# EasyEDA Pro project ProProject_基于CW32单片机的伺服电机控制器_2024-03-17.epro

# Schematic Schematic1

## Sheets
1 P1: Create Date: 2024-02-22; Page Name: P1; Project Name: 基于CW32单片机的伺服电机控制器; Schematic Name: Schematic1; Update Date: 2024-03-03; Company: 嘉立创EDA; Page Size: A4; Version: V1.0
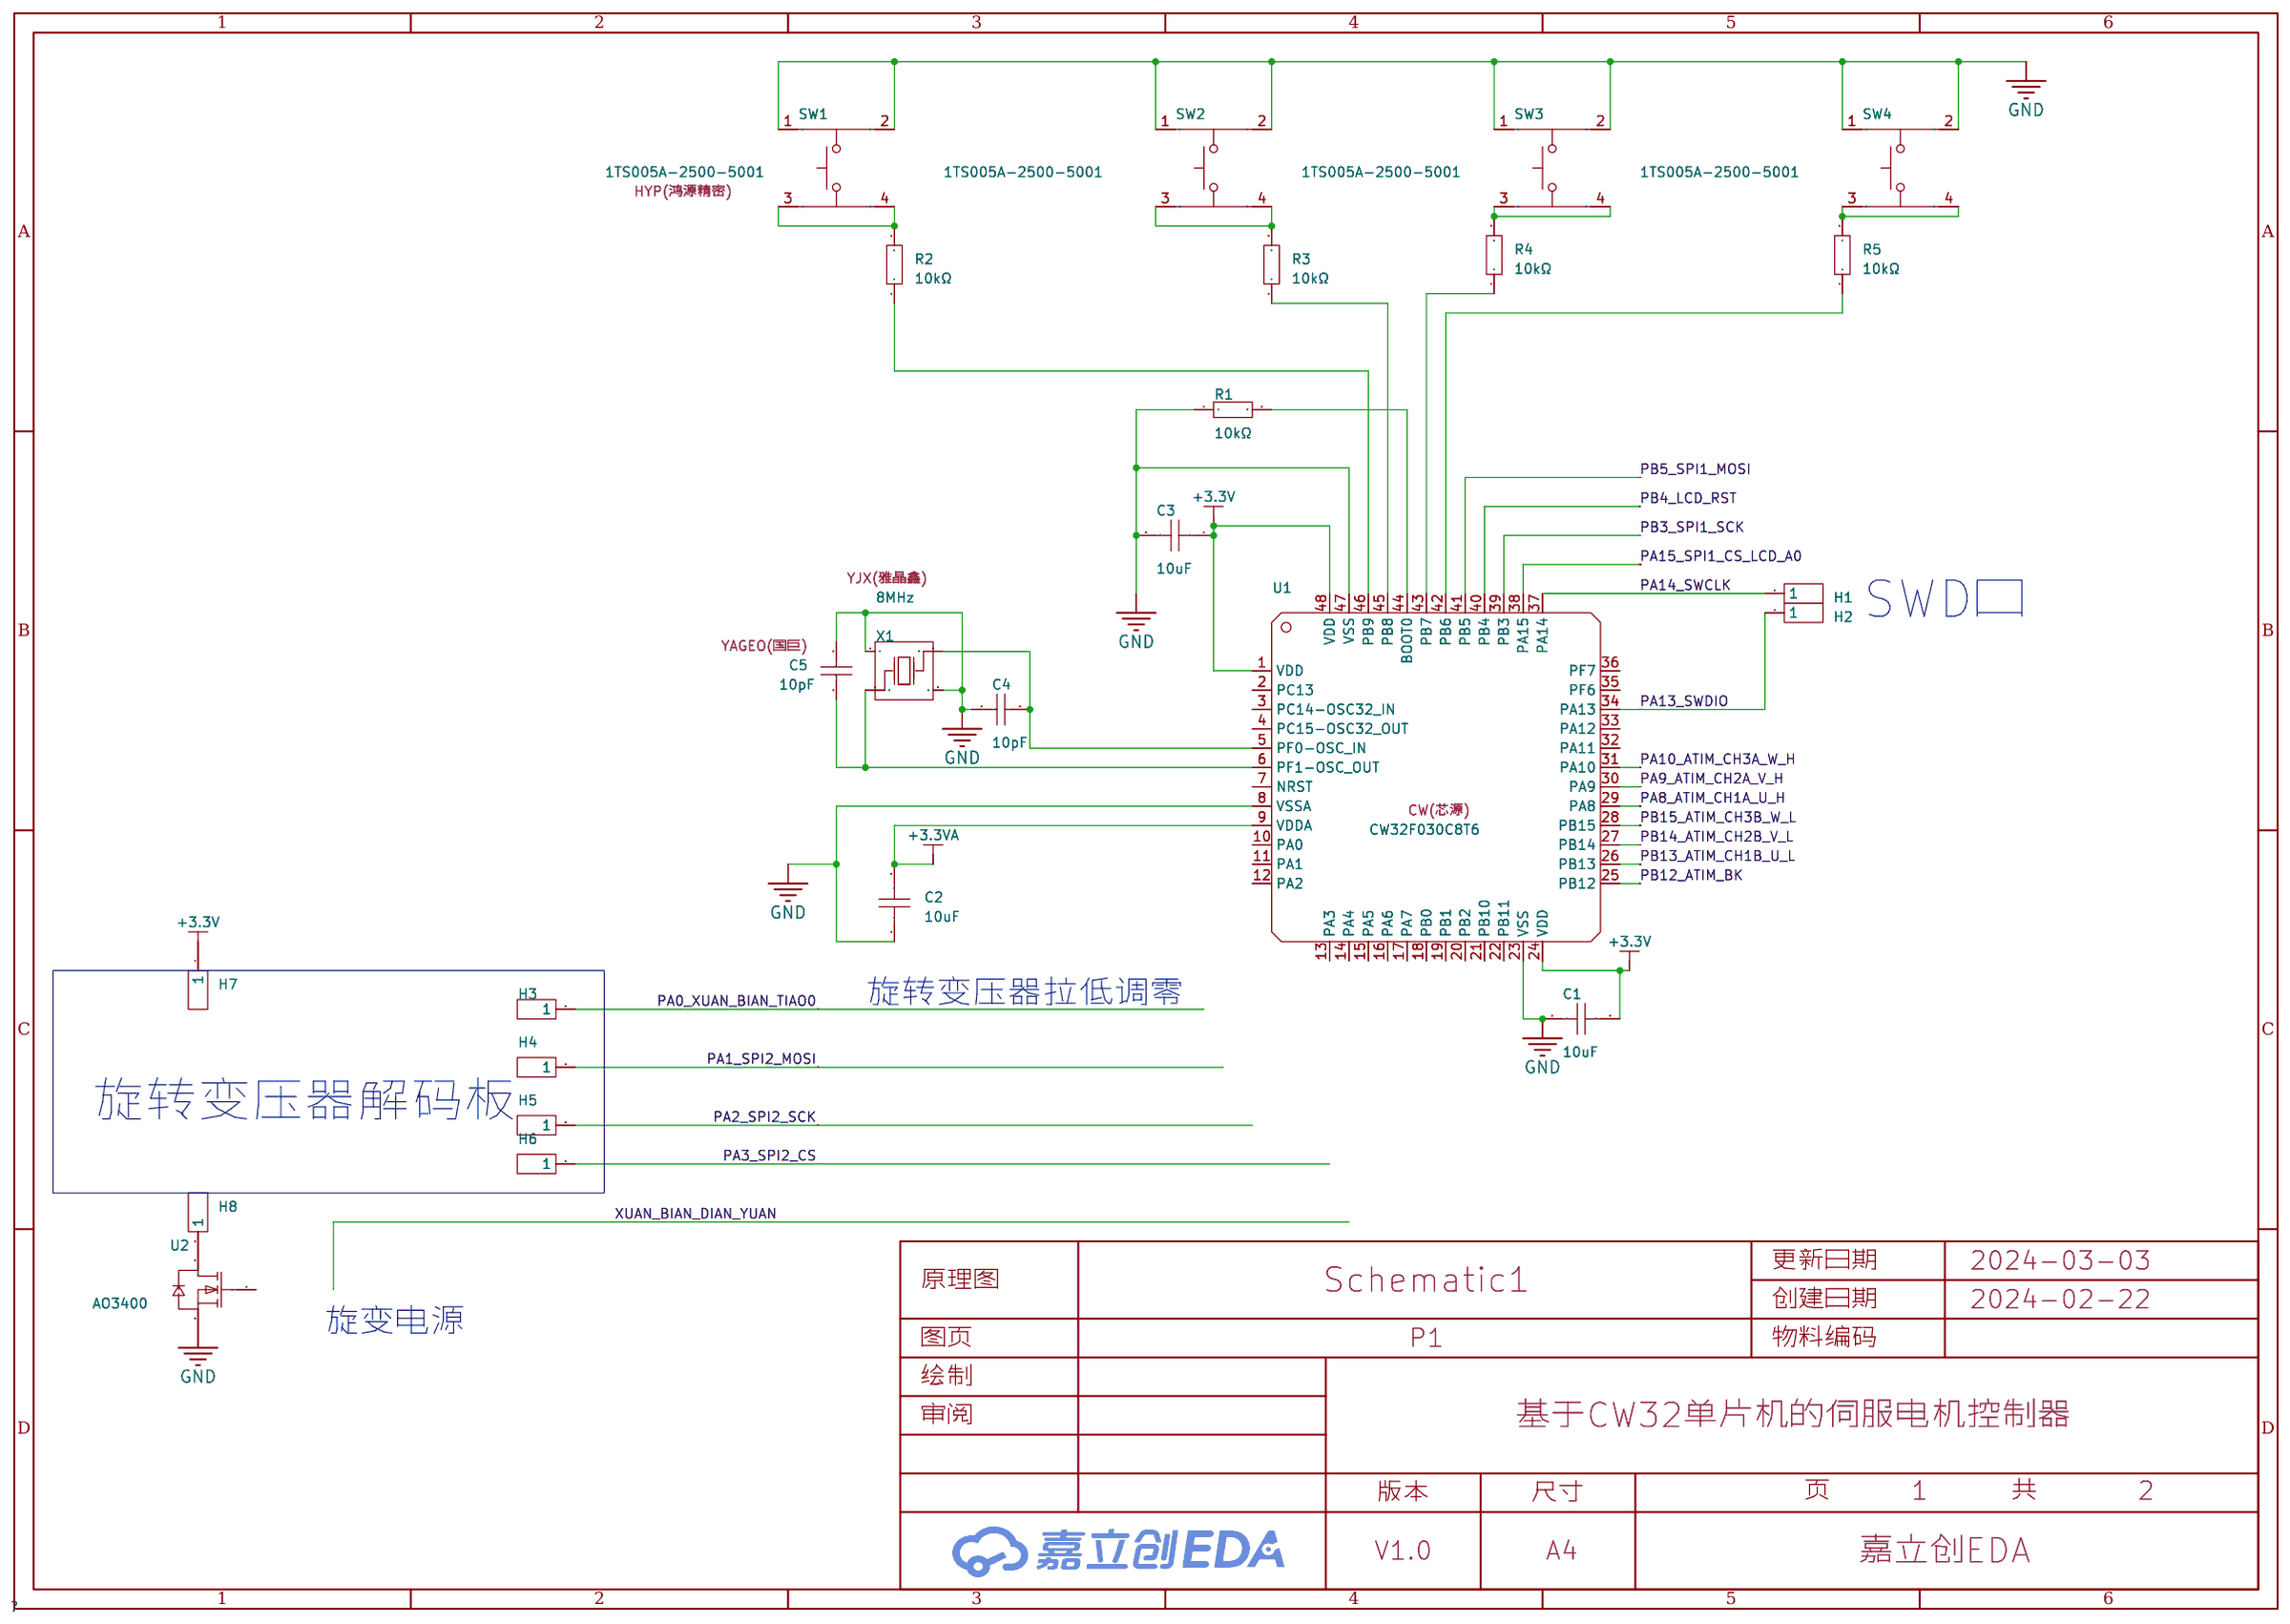
[diagram p0: P1]
2 P2: Create Date: 2024-03-02; Page Name: P2
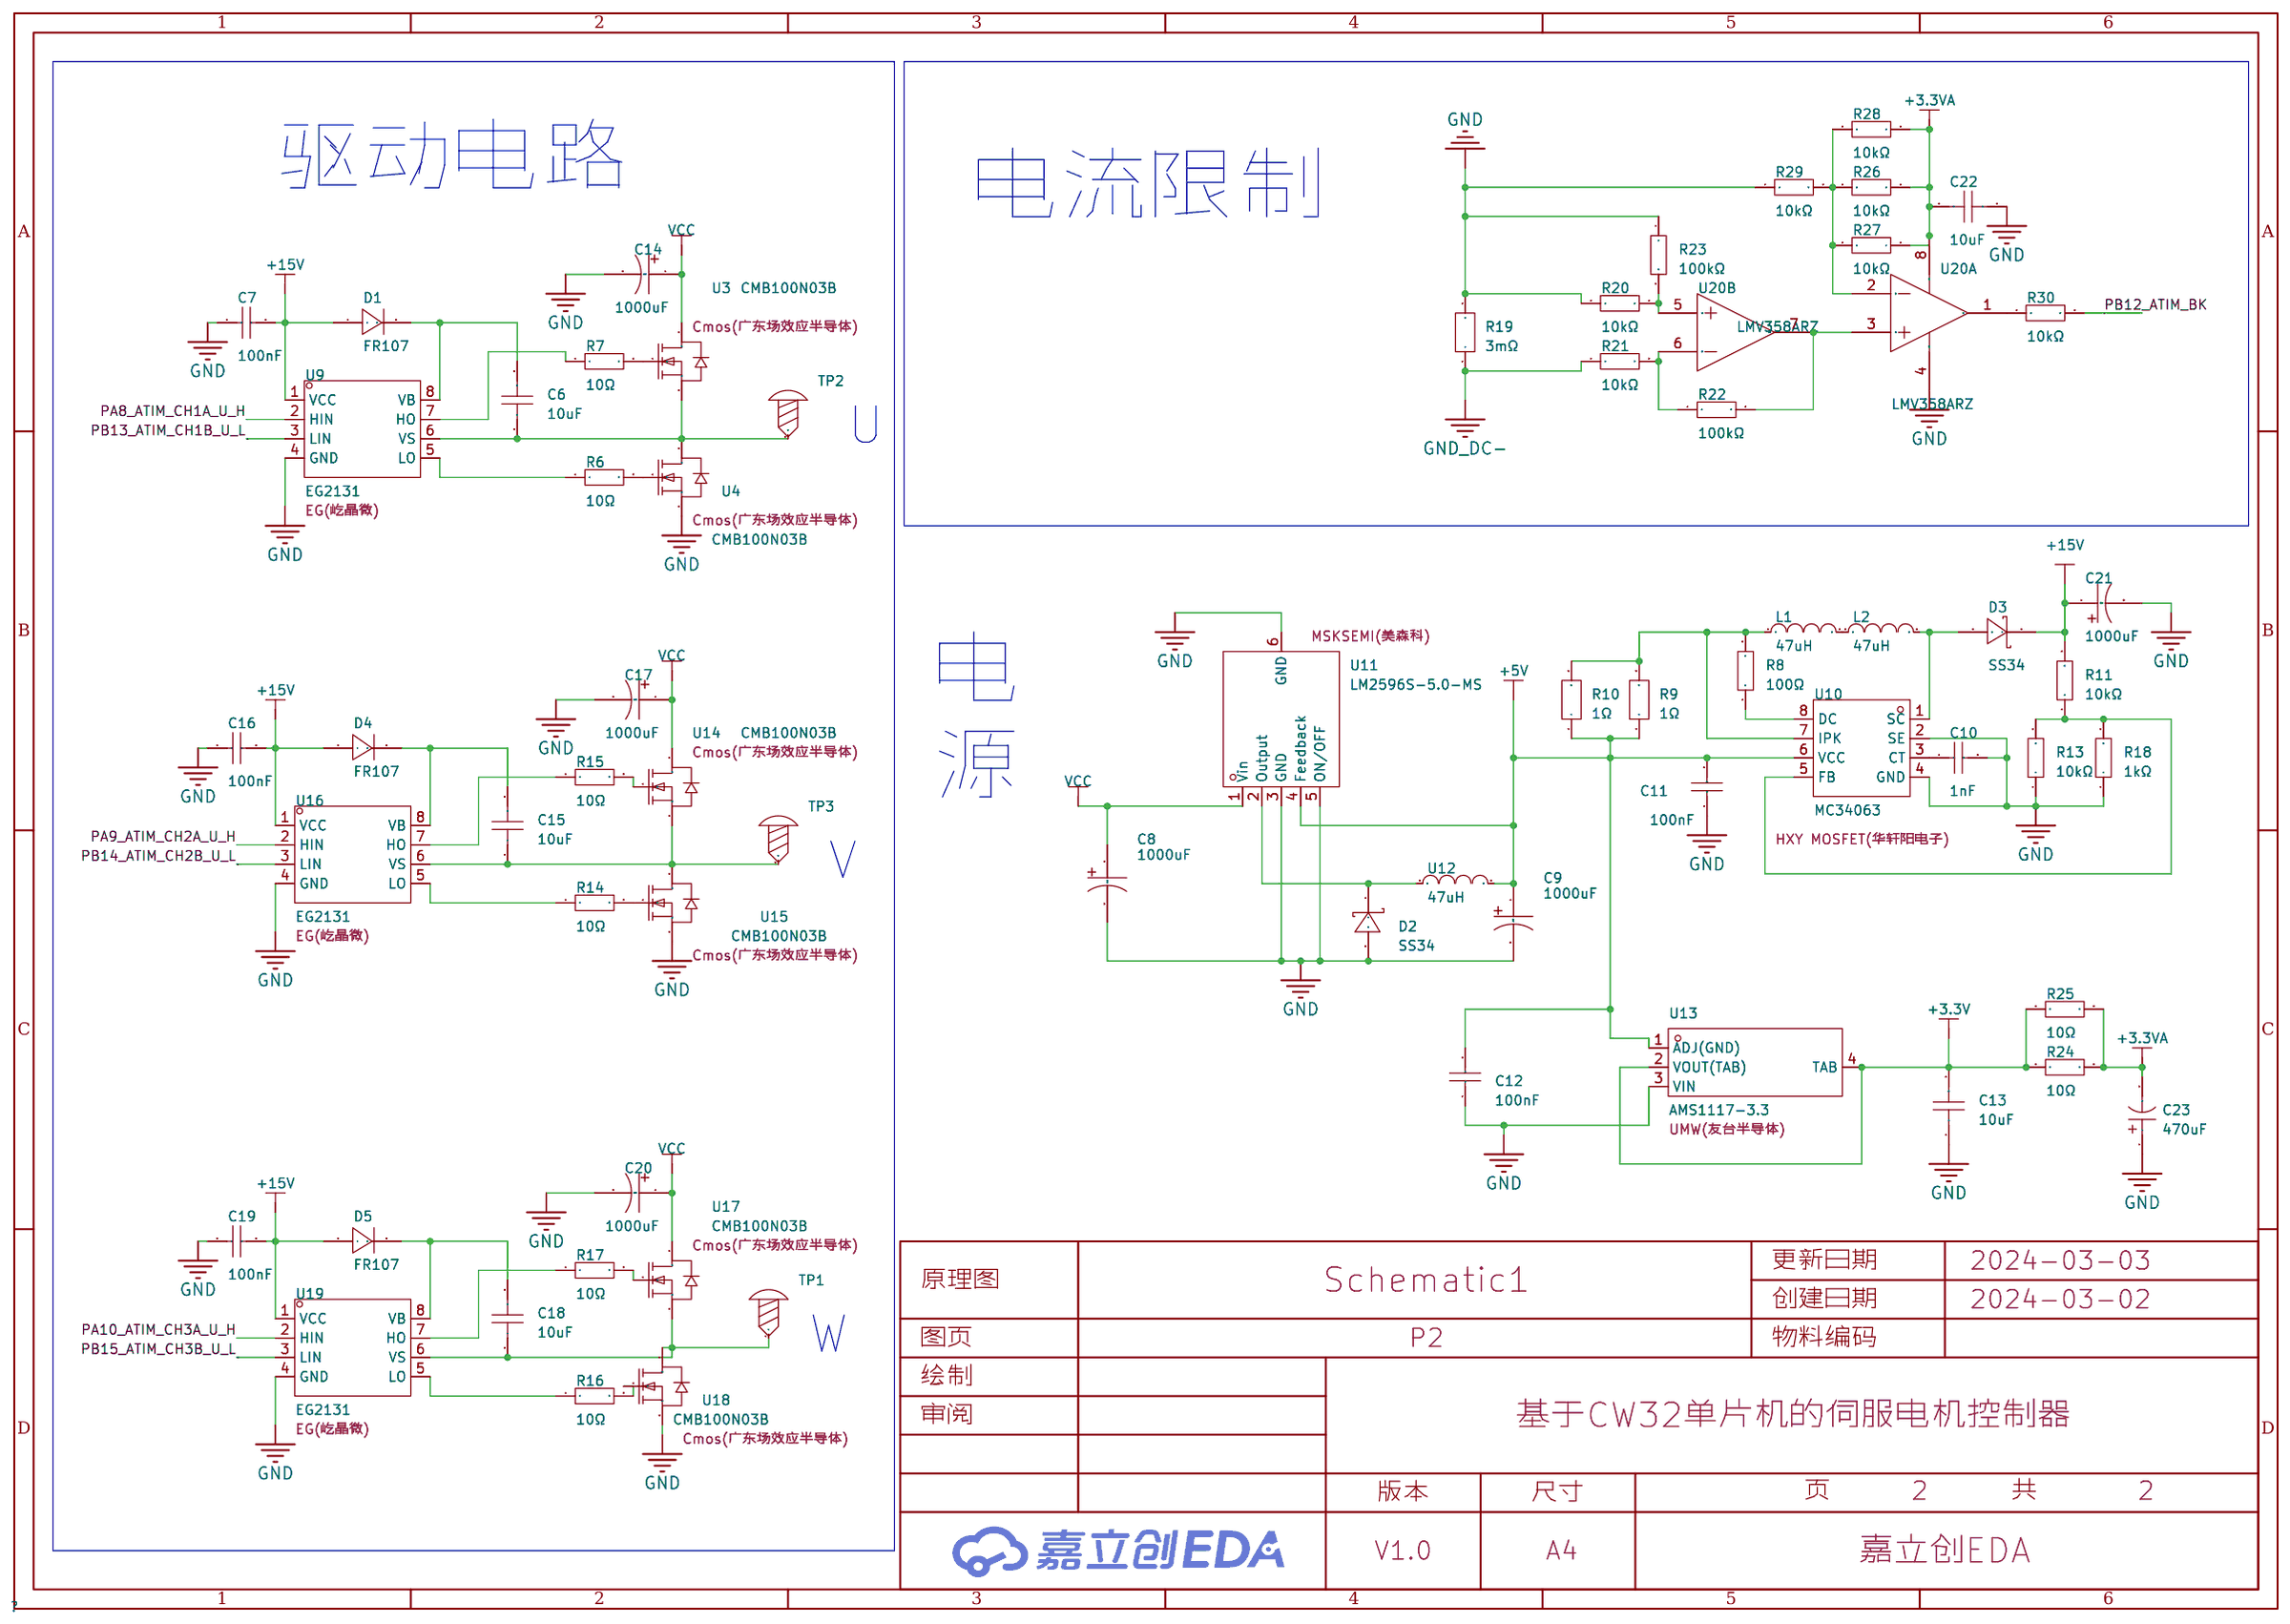
[diagram p1: P2]

## Parts
sheet P1
C1  10uF  [C0603]
C2  10uF  [C0603]
C3  10uF  [C0603]
C4  10pF  [C0603]
C5  10pF  [C0603]
H1  -  [HDR-TH_1P-V-M_XKB_X4611WV-01I-C28D40]
H2  -  [HDR-TH_1P-V-M_XKB_X4611WV-01I-C28D40]
H3  -  [HDR-TH_1P-V-M_XKB_X4611WV-01I-C28D40]
H4  -  [HDR-TH_1P-V-M_XKB_X4611WV-01I-C28D40]
H5  -  [HDR-TH_1P-V-M_XKB_X4611WV-01I-C28D40]
H6  -  [HDR-TH_1P-V-M_XKB_X4611WV-01I-C28D40]
H7  -  [HDR-TH_1P-V-M_XKB_X4611WV-01I-C28D40]
H8  -  [HDR-TH_1P-V-M_XKB_X4611WV-01I-C28D40]
R1  10kΩ  [R0603]
R2  10kΩ  [R0603]
R3  10kΩ  [R0603]
R4  10kΩ  [R0603]
R5  10kΩ  [R0603]
SW1  1TS005A-2500-5001  [SW-TH_4P-L6.0-W6.0-P3.90-LS6.5]
SW2  1TS005A-2500-5001  [SW-TH_4P-L6.0-W6.0-P3.90-LS6.5]
SW3  1TS005A-2500-5001  [SW-TH_4P-L6.0-W6.0-P3.90-LS6.5]
SW4  1TS005A-2500-5001  [SW-TH_4P-L6.0-W6.0-P3.90-LS6.5]
U1  CW32F030C8T6  [LQFP-48_L7.0-W7.0-P0.50-LS9.0-TL]
U2  AO3400  [SOT-23-3_L2.9-W1.3-P0.95-LS2.4-BR]
X1  8MHz  [OSC-SMD_4P-L3.2-W2.5-BL]
sheet P2
C6  10uF  [C0805]
C7  100nF  [C0603]
C8  1000uF  [CAP-TH_BD10.0-P5.00-D1.0-FD]
C9  1000uF  [CAP-TH_BD10.0-P5.00-D1.0-FD]
C10  1nF  [C0603]
C11  100nF  [C0603]
C12  100nF  [C0603]
C13  10uF  [C0603]
C14  1000uF  [CAP-TH_BD10.0-P5.00-D1.0-FD]
C15  10uF  [C0805]
C16  100nF  [C0603]
C17  1000uF  [CAP-TH_BD10.0-P5.00-D1.0-FD]
C18  10uF  [C0805]
C19  100nF  [C0603]
C20  1000uF  [CAP-TH_BD10.0-P5.00-D1.0-FD]
C21  1000uF  [CAP-TH_BD10.0-P5.00-D1.0-FD]
C22  10uF  [C0603]
C23  470uF  [CAP-TH_BD10.0-P5.00-D0.6-FD]
D1  FR107  [DO-41_BD2.4-L4.7-P8.70-D0.9-FD]
D2  SS34  [SMA_L4.3-W2.6-LS5.2-RD]
D3  SS34  [SMA_L4.3-W2.6-LS5.2-RD]
D4  FR107  [DO-41_BD2.4-L4.7-P8.70-D0.9-FD]
D5  FR107  [DO-41_BD2.4-L4.7-P8.70-D0.9-FD]
L1  47uH  [IND-SMD_L4.5-W4.0_SLF0403]
L2  47uH  [IND-SMD_L4.5-W4.0_SLF0403]
R6  10Ω  [R0603]
R7  10Ω  [R0603]
R8  100Ω  [R0603]
R9  1Ω  [R0603]
R10  1Ω  [R0603]
R11  10kΩ  [R0603]
R13  10kΩ  [R0603]
R14  10Ω  [R0603]
R15  10Ω  [R0603]
R16  10Ω  [R0603]
R17  10Ω  [R0603]
R18  1kΩ  [R0603]
R19  3mΩ  [R5930]
R20  10kΩ  [R0603]
R21  10kΩ  [R0603]
R22  100kΩ  [R0603]
R23  100kΩ  [R0603]
R24  10Ω  [R0603]
R25  10Ω  [R0603]
R26  10kΩ  [R0603]
R27  10kΩ  [R0603]
R28  10kΩ  [R0603]
R29  10kΩ  [R0603]
R30  10kΩ  [R0603]
TP1  -  [M4螺丝]
TP2  -  [M4螺丝]
TP3  -  [M4螺丝]
U3  CMB100N03B  [TO-263-2_L10.1-W9.1-P5.08-LS15.2-BR]
U4  CMB100N03B  [TO-263-2_L10.1-W9.1-P5.08-LS15.2-BR]
U9  EG2131  [SOIC-8_L5.0-W4.0-P1.27-LS6.0-BL]
U10  MC34063  [SOIC-8_L5.0-W4.0-P1.27-LS6.0-BL]
U11  LM2596S-5.0-MS  [TO-263-5_L10.0-W8.4-P1.70-LS15.3-BR]
U12  47uH  [IND-SMD_L7.1-W6.6]
U13  AMS1117-3.3  [SOT-223-4_L6.5-W3.5-P2.30-LS7.0-BR]
U14  CMB100N03B  [TO-263-2_L10.1-W9.1-P5.08-LS15.2-BR]
U15  CMB100N03B  [TO-263-2_L10.1-W9.1-P5.08-LS15.2-BR]
U16  EG2131  [SOIC-8_L5.0-W4.0-P1.27-LS6.0-BL]
U17  CMB100N03B  [TO-263-2_L10.1-W9.1-P5.08-LS15.2-BR]
U18  CMB100N03B  [TO-263-2_L10.1-W9.1-P5.08-LS15.2-BR]
U19  EG2131  [SOIC-8_L5.0-W4.0-P1.27-LS6.0-BL]
U20  LMV358ARZ  [SOP-8_L4.9-W3.9-P1.27-LS6.0-BL]  (sections 1,2)

## Library data of the parts
C1-C3 C13 C22 = CL10A106KP8NNNC: 容值:10uF;精度:±10%;额定电压:10V;材质(温度系数):X5R;; LCSC Part Name: 10uF ±10% 10V; Supplier Part: C19702; Manufacturer: SAMSUNG(三星); Supplier Footprint: 0603; JLCPCB Part Class: 基础库; Datasheet: https://atta.szlcsc.com/upload/public/pdf/source/20160218/1457707763339.pdf; Supplier: LCSC; Tolerance: ±10%; Voltage Rated: 10V; Temperature Coefficient: X5R
C4 C5 = CC0603JRNPO9BN100: 容值:10pF;精度:±5%;额定电压:50V;材质(温度系数):NP0;; LCSC Part Name: 10pF ±5% 50V; Supplier Part: C106245; Manufacturer: YAGEO(国巨); Supplier Footprint: 0603; JLCPCB Part Class: 扩展库; Datasheet: https://atta.szlcsc.com/upload/public/pdf/source/20170505/1493957838062.pdf; Supplier: LCSC; Tolerance: ±5%; Voltage Rated: 50V; Temperature Coefficient: NP0
H1-H8 = HDR-M_2.54_1x1P: Supplier Part: C81276; Supplier Footprint: 插件; JLCPCB Part Class: Extended Part
R1-R5 R11 R13 R20 R21 R26-R30 = RC0603FR-0710KL: 电阻类型:厚膜电阻;阻值:10kΩ;精度:±1%;功率:100mW;最大工作电压:75V;温度系数:±100ppm/℃;; LCSC Part Name: 厚膜电阻 10kΩ ±1% 100mW; Supplier Part: C98220; Manufacturer: YAGEO(国巨); Supplier Footprint: 0603; JLCPCB Part Class: 扩展库; Datasheet: https://atta.szlcsc.com/upload/public/pdf/source/20180927/C295883_E8D83085EA81BD7DE0B2B681138C15EE.pdf; Supplier: LCSC; Type: 厚膜电阻; Tolerance: ±1%; Power(Watts): 100mW; Overload Voltage (Max): 75V; Temperature Coefficient: ±100ppm/℃; Operating Temperature Range: -55℃~+155℃
SW1-SW4 = 1TS005A-2500-5001: 电路结构:单刀单掷;按钮形状:圆形按钮;作用力:250gf;安装方式:直插;开关长度:6mm;开关宽度:6mm;开关高度:5mm;带支架:不带;触点电流:50mA;额定电压(DC):12V;额定功率:0.6W;绝缘电阻:100MΩ;带灯:无;机械寿命:7万次;; LCSC Part Name: 6*6*5mm 直插 轻触开关; Supplier Part: C255811; Manufacturer: HYP(鸿源精密); Supplier Footprint: 插件,6x6mm; JLCPCB Part Class: 扩展库; Datasheet: https://atta.szlcsc.com/upload/public/pdf/source/20180720/C255811_DA12C4E3C20854D48E888AEA64926F5F.pdf; Supplier: LCSC; Circuit: 单刀单掷; Actuator Style: 圆形按钮; Operating Force: 250gf; Mounting Style: 直插; Switch Length: 6mm; Switch Width: 6mm; Switch Height: 5mm; Strike Gundam: 不带; Contact Current: 50mA; Voltage Rating (DC): 12V; Power Rating: 0.6W; Insulation Resistance: 100MΩ; Actuator/Cap Color: 黑色; With Lamp: 无; Pin Style: PC引脚; Mechanical Life: 7万次; Operating Temperature: -40℃~+90℃
U1 = CW32F030C8T6_C3019113: CPU内核:ARM-M系列;RAM总容量:8KB;GPIO端口数量:39;工作电压范围:1.65V~5.5V;CPU最大主频:64MHz;程序存储器类型:-;; Supplier Part: C3019113; Manufacturer: CW(芯源); Supplier Footprint: LQFP-48(7x7); JLCPCB Part Class: 扩展库; Datasheet: https://atta.szlcsc.com/upload/public/pdf/source/20220516/D60F5E1023A73FFF550D4A77416DDFBC.pdf; Supplier: LCSC; CPU Core: ARM-M系列; RAM Size: 8KB; GPIO Ports Number: 39; Operating Voltage Range: 1.65V~5.5V; CPU Maximum Speed: 64MHz; Operating Temperature Range: -40℃~+105℃; ADC (Bit): 12bit; 16Bit Timer: 8; UART/USART: 3; I2C: 2; SPI: 2; Internal Comparator: 有; Peripheral/Function: 片载温度传感器；DMA；看门狗；低电压检测；CRC校验; Watchdog: 有; Low-Voltage Detect: 有; Direct Memory Access: 有
U2 = AO3400_C5224189: 类型:N沟道;漏源电压(Vdss):30V;连续漏极电流(Id):6A;功率(Pd):1.4W;导通电阻(RDS(on)@Vgs,Id):19mΩ@10V,6.0A;阈值电压(Vgs(th)@Id):1V@250uA;; LCSC Part Name: N沟道 耐压:30V 电流:6A; Supplier Part: C5224189; Manufacturer: ElecSuper(静芯微); Supplier Footprint: SOT-23; JLCPCB Part Class: 扩展库; Datasheet: https://atta.szlcsc.com/upload/public/pdf/source/20221027/ABD635DBC9233A91F749288ED25D371B.pdf; Supplier: LCSC; Type: N沟道; Drain Source Voltage (Vdss): 30V; Continuous Drain Current (Id): 6A; Power Dissipation (Pd): 1.4W; Drain Source On Resistance (RDS(on)@Vgs,Id): 19mΩ@10V,6.0A; Gate Threshold Voltage (Vgs(th)@Id): 1V@250uA
X1 = TAXM8M4RDBCCT2T: 晶振类型:贴片晶振;频率:8MHz;常温频差:±10ppm;外接负载电容:10pF;频率稳定度(全温):±15ppm;; LCSC Part Name: 8MHz ±10ppm 10pF; Supplier Part: C400090; Manufacturer: YJX(雅晶鑫); Supplier Footprint: SMD3225-4P; JLCPCB Part Class: 扩展库; Datasheet: https://atta.szlcsc.com/upload/public/pdf/source/20190626/C400090_CF95B89E745AFE4EF2E392EF8AC009D6.pdf; Supplier: LCSC; Crystal Type: 贴片晶振; Normal temperature Frequency Tolerance: ±10ppm; External load capacitor: 10pF; Frequency Stability(Full temperature range): ±15ppm; Equivalent Series Resistance (ESR): 250Ω; Operating Temperature: -40℃~+85℃
C6 C15 C18 = CL21A106KAYNNNE_C15850: 容值:10uF;精度:±10%;额定电压:25V;材质(温度系数):X5R;; LCSC Part Name: 10uF ±10% 25V; Supplier Part: C15850; Manufacturer: SAMSUNG(三星); Manufacturer Part: CL21A106KAYNNNE; Supplier Footprint: 0805; JLCPCB Part Class: 基础库; Datasheet: https://atta.szlcsc.com/upload/public/pdf/source/20160218/1457707763339.pdf; Supplier: LCSC; Tolerance: ±10%; Voltage Rated: 25V; Temperature Coefficient: X5R
C7 C11 C12 C16 C19 = 0603B104K500NT: 容值:100nF;精度:±10%;额定电压:50V;材质(温度系数):X7R;; LCSC Part Name: 100nF ±10% 50V; Supplier Part: C30926; Manufacturer: FH(风华); Supplier Footprint: 0603; JLCPCB Part Class: 扩展库; Datasheet: https://atta.szlcsc.com/upload/public/pdf/source/20200305/C486355_26A10D38EF8C2A5C37091D0039909270.pdf; Supplier: LCSC; Tolerance: ±10%; Voltage Rated: 50V; Temperature Coefficient: X7R
C8 C9 C14 C17 C20 C21 = ERR1VM102G20OT: 容值:1000uF;精度:±20%;额定电压:35V;; LCSC Part Name: 1000uF ±20% 35V; Supplier Part: C398835; Manufacturer: AISHI(艾华集团); Supplier Footprint: 插件,D10xL20mm; JLCPCB Part Class: 扩展库; Datasheet: https://atta.szlcsc.com/upload/public/pdf/source/20190702/C401591_1676EF45BC9A88BD1D6B22BBAE3913C7.pdf; Supplier: LCSC; Tolerance: ±20%; Rated Voltage: 35V; Lead Spacing: 5mm; φD: 10mm; L: 20mm; Lifetime @ Temp: 2000hrs@105℃
C10 = CC0603JRNPO9BN102: 容值:1nF;精度:±5%;额定电压:50V;材质(温度系数):NP0;; LCSC Part Name: 1nF ±5% 50V; Supplier Part: C106246; Manufacturer: YAGEO(国巨); Supplier Footprint: 0603; JLCPCB Part Class: 扩展库; Datasheet: https://atta.szlcsc.com/upload/public/pdf/source/20170505/1493957838062.pdf; Supplier: LCSC; Tolerance: ±5%; Voltage Rated: 50V; Temperature Coefficient: NP0
C23 = 35V470uF CD110: 容值:470uF;精度:±20%;额定电压:35V;; LCSC Part Name: 470uF ±20% 35V; Supplier Part: C2960394; Manufacturer: HRK(鸿瑞凯电子); Supplier Footprint: 插件,D10xL17mm; JLCPCB Part Class: 扩展库; Datasheet: https://atta.szlcsc.com/upload/public/pdf/source/20220224/D53946E56E2AF613ECCDBE172010D613.pdf; Supplier: LCSC; Tolerance: ±20%; Rated Voltage: 35V; Lead Spacing: 5mm; φD: 10mm; L: 17mm; Operating Temperature: -40℃~+105℃
D1 D4 D5 = FR107_C35253: 二极管配置:-;正向压降(Vf):1.3V@1A;直流反向耐压(Vr):1kV;平均整流电流(Io):1A;反向恢复时间(trr):500ns;; LCSC Part Name: 电压:1kV 电流:1A; Supplier Part: C35253; Manufacturer: MDD; Supplier Footprint: DO-41; JLCPCB Part Class: 扩展库; Datasheet: https://atta.szlcsc.com/upload/public/pdf/source/20230823/95EC475391AED3EACDBE81DA6E12F611.pdf; Supplier: LCSC; Forward Voltage (Vf@If): 1.3V@1A; Reverse Voltage (Vr): 1kV; Average Rectified Current (Io): 1A; Reverse Leakage Current: 5uA@1kV; Reverse Recovery Time (trr): 500ns; Operating Temperature: -65℃~+150℃@(Tj)
D2 D3 = SS34_C8678: 二极管配置:独立式;正向压降(Vf):550mV@3A;直流反向耐压(Vr):40V;平均整流电流(Io):3A;; LCSC Part Name: 电压:40V 电流:3A; Supplier Part: C8678; Manufacturer: MDD; Supplier Footprint: SMA(DO-214AC); JLCPCB Part Class: 基础库; Datasheet: https://atta.szlcsc.com/upload/public/pdf/source/20230314/A80AE34493C69B89E2F4B1712F433538.pdf; Supplier: LCSC; Diode Configuration: 独立式; Forward Voltage (Vf@If): 550mV@3A; Reverse Voltage (Vr): 40V; Average Rectified Current (Io): 3A; Reverse Leakage Current (Ir): 500uA@40V
L1 L2 = SLF0403-470KTT: 电感值:47uH;精度:±10%;额定电流:540mA;; LCSC Part Name: 47uH ±10%; Supplier Part: C182152; Manufacturer: Sunltech(韩国顺磁); Supplier Footprint: SMD; JLCPCB Part Class: 扩展库; Datasheet: https://atta.szlcsc.com/upload/public/pdf/source/20180622/C182201_C2E2778B6752CF513C201C52BBFBA88C.pdf; Supplier: LCSC; Tolerance: ±10%; Rated Current: 540mA; DC Resistance (DCR): 844mΩ
R6 R7 R14-R17 R24 R25 = 0603WAF100JT5E: 电阻类型:厚膜电阻;阻值:10Ω;精度:±1%;功率:100mW;最大工作电压:75V;温度系数:±400ppm/℃;; LCSC Part Name: 10Ω ±1% 100mW 厚膜电阻; Supplier Part: C22859; Manufacturer: UNI-ROYAL(厚声); Supplier Footprint: 0603; JLCPCB Part Class: 基础库; Datasheet: https://atta.szlcsc.com/upload/public/pdf/source/20200306/C422600_1E6D84923E4A46A82E41ADD87F860B5C.pdf; Supplier: LCSC; Type: 厚膜电阻; Tolerance: ±1%; Power(Watts): 100mW; Overload Voltage (Max): 75V; Temperature Coefficient: ±400ppm/℃; Operating Temperature Range: -55℃~+155℃
R8 = RC0603FR-07100RL: 电阻类型:厚膜电阻;阻值:100Ω;精度:±1%;功率:100mW;最大工作电压:75V;温度系数:±100ppm/℃;; LCSC Part Name: 厚膜电阻 100Ω ±1% 100mW; Supplier Part: C105588; Manufacturer: YAGEO(国巨); Supplier Footprint: 0603; JLCPCB Part Class: 扩展库; Datasheet: https://atta.szlcsc.com/upload/public/pdf/source/20180316/70C0E2BDAE7FCC62C531A5A58D202EE1.pdf; Supplier: LCSC; Type: 厚膜电阻; Tolerance: ±1%; Power(Watts): 100mW; Overload Voltage (Max): 75V; Temperature Coefficient: ±100ppm/℃; Operating Temperature Range: -55℃~+155℃
R9 R10 = SCR0603F1R: 电阻类型:厚膜电阻;阻值:1Ω;精度:±1%;功率:100mW;最大工作电压:75V;; LCSC Part Name: 1Ω ±1%; Supplier Part: C3016186; Manufacturer: VO(翔胜); Supplier Footprint: 0603; JLCPCB Part Class: 扩展库; Datasheet: https://atta.szlcsc.com/upload/public/pdf/source/20220513/247AF9639BA21CF93567DC289CCC6A22.pdf; Supplier: LCSC; Type: 厚膜电阻; Tolerance: ±1%; Power(Watts): 100mW; Overload Voltage (Max): 75V; Operating Temperature Range: -55℃~+155℃
R18 = RC0603FR-071KL: 电阻类型:厚膜电阻;阻值:1kΩ;精度:±1%;功率:100mW;最大工作电压:75V;温度系数:±100ppm/℃;; LCSC Part Name: 厚膜电阻 1kΩ ±1% 100mW; Supplier Part: C22548; Manufacturer: YAGEO(国巨); Supplier Footprint: 0603; JLCPCB Part Class: 扩展库; Datasheet: https://atta.szlcsc.com/upload/public/pdf/source/20180316/70C0E2BDAE7FCC62C531A5A58D202EE1.pdf; Supplier: LCSC; Type: 厚膜电阻; Tolerance: ±1%; Power(Watts): 100mW; Overload Voltage (Max): 75V; Temperature Coefficient: ±100ppm/℃; Operating Temperature Range: -55℃~+155℃
R19 = EBWS5930F3L00K9L: 电阻类型:采样电阻;阻值:3mΩ;精度:±1%;额定压降:-;功率:7W;温度系数:±100ppm/℃;安装方式:贴片;; LCSC Part Name: 3mΩ ±1% 7W; Supplier Part: C494596; Manufacturer: RESI(开步睿思）; Supplier Footprint: 5930; JLCPCB Part Class: 扩展库; Datasheet: https://atta.szlcsc.com/upload/public/pdf/source/20200428/C494572_1906A236A7F16EA247B6F3B5657545A5.pdf; Supplier: LCSC; Type: 采样电阻; Tolerance: ±1%; Power(Watts): 7W; Temperature Coefficient: ±100ppm/℃; Mounting Sytle: 贴片
R22 R23 = RC0603FR-07100KL: 电阻类型:厚膜电阻;阻值:100kΩ;精度:±1%;功率:100mW;最大工作电压:75V;温度系数:±100ppm/℃;; LCSC Part Name: 厚膜电阻 100kΩ ±1% 100mW; Supplier Part: C14675; Manufacturer: YAGEO(国巨); Supplier Footprint: 0603; JLCPCB Part Class: 扩展库; Datasheet: https://atta.szlcsc.com/upload/public/pdf/source/20140324/1457707028752.pdf; Supplier: LCSC; Type: 厚膜电阻; Tolerance: ±1%; Power(Watts): 100mW; Overload Voltage (Max): 75V; Temperature Coefficient: ±100ppm/℃; Operating Temperature Range: -55℃~+155℃
TP1-TP3 = M4螺丝: Supplier Footprint: 插件
U3 U4 U14 U15 U17 U18 = CMB100N03B: 类型:N沟道;漏源电压(Vdss):30V;连续漏极电流(Id):100A;功率(Pd):300W;导通电阻(RDS(on)@Vgs,Id):4.5mΩ;; LCSC Part Name: N沟道 耐压:30V 电流:100A; Supplier Part: C5371853; Manufacturer: Cmos(广东场效应半导体); Supplier Footprint: TO-263; Datasheet: https://atta.szlcsc.com/upload/public/pdf/source/20230320/165F92A3EFB77C9B94AB5AF0C8680DBE.pdf; Supplier: LCSC; Type: N沟道; Drain Source Voltage (Vdss): 30V; Continuous Drain Current (Id): 100A; Power Dissipation (Pd): 300W; Drain Source On Resistance (RDS(on)@Vgs,Id): 4.5mΩ
U9 U16 U19 = EG2131: Supplier Part: C193777; Manufacturer: EG(屹晶微); Supplier Footprint: SOIC-8; JLCPCB Part Class: 扩展库; Datasheet: https://atta.szlcsc.com/upload/public/pdf/source/20180528/C193777_0A452F93B99FD4EB2A9D54E9055DABCE.pdf; Supplier: LCSC
U10 = MC34063_C5349988: 功能类型:升降压型;输出类型:可调;输入电压:3V~40V;输出电压:1.25V~40V;输出电流(最大值):1.3A;; Supplier Part: C5349988; Manufacturer: HXY MOSFET(华轩阳电子); Supplier Footprint: SOP-8; JLCPCB Part Class: 扩展库; Datasheet: https://atta.szlcsc.com/upload/public/pdf/source/20231229/D1A87F39F2F1E3F68C55B6C50423EC0B.pdf; Supplier: LCSC; Function: 升降压型; Output Type: 可调; Input Voltage: 3V~40V; Output Voltage: 1.25V~40V; Output Current (Max): 1.3A; Switching Frequency: 100kHz; Operating Temperature: 0℃~+70℃; Number of Outputs: 1; Switch tube (built-in/external): 内置
U11 = LM2596S-5.0-MS: 功能类型:降压型;输出类型:-;输入电压:7V~40V;输出电压:5V;输出电流(最大值):3A;; LCSC Part Name: Vin=7V-40V Vout=5V 3A大电流; Supplier Part: C5174628; Manufacturer: MSKSEMI(美森科); Supplier Footprint: TO-263-5L; JLCPCB Part Class: 扩展库; Datasheet: https://atta.szlcsc.com/upload/public/pdf/source/20221027/4361E163E0CC4DA461A3D8885FDCEFBB.pdf; Supplier: LCSC; Function: 降压型; Input Voltage: 7V~40V; Output Voltage: 5V; Output Current (Max): 3A; Switching Frequency: 150kHz; Synchronous Rectification: 否; Number of Outputs: 1; Topology: 降压式; Switch tube (built-in/external): 内置
U12 = APH0630T470M: 电感值:47uH;精度:±20%;额定电流:1.25A;饱和电流(Isat):1.66A;类型:一体成型电感;; LCSC Part Name: 47uH ±20% 1.66A; Supplier Part: C5349685; Manufacturer: APV(爱普微); Supplier Footprint: SMD,7x6.6mm; JLCPCB Part Class: 扩展库; Datasheet: https://atta.szlcsc.com/upload/public/pdf/source/20230920/8DF4F91CA8787177DE496A10F73889DA.pdf; Supplier: LCSC; Tolerance: ±20%; Rated Current: 1.25A; Saturation Current (Isat): 1.66A; DC Resistance (DCR): 385mΩ; Type: 一体成型电感
U13 = AMS1117-3.3_C347222: 输出类型:固定;最大输入电压:12V;输出电压:3.3V;最大输出电流:1A;电源纹波抑制比(PSRR):60dB@(120Hz);输出极性:正极;; LCSC Part Name: 输出:3.3V 电流:1A 耐压:12V; Supplier Part: C347222; Manufacturer: UMW(友台半导体); Supplier Footprint: SOT-223; JLCPCB Part Class: 扩展库; Datasheet: https://atta.szlcsc.com/upload/public/pdf/source/20231109/155D79A26D9DB04352555A58D5969DC8.pdf; Supplier: LCSC; Output Type: 固定; Maximum Input Voltage: 12V; Output Voltage: 3.3V; MAX Output Current: 1A; Power Supply Rejection Ratio (PSRR): 60dB@(120Hz); Dropout Voltage: 1.3V@(1A); Output Polarity: 正极; Number of Outputs: 1
U20 = LMV358ARZ: 放大器数:双路;; Supplier Part: C2928823; Manufacturer: HTCSEMI(海天芯); Supplier Footprint: SOP-8; JLCPCB Part Class: 扩展库; Datasheet: https://atta.szlcsc.com/upload/public/pdf/source/20220114/2D4B849A76DE33264688A93B3A90A0F8.pdf; Supplier: LCSC; Number of Circuits: 双路

## Nets
+3.3V: C1.2 C3.1 C13.2 H7.1 R24.1 R25.1 U1.1(VDD) U1.24(VDD) U1.48(VDD) U13.2(VOUT(TAB)) U13.4(TAB)
+3.3VA: C2.2 C22.2 C23.2 R24.2 R25.2 R26.2 R27.2 R28.2 U1.9(VDDA) U20.8(VCC)
+5V: C9.1 C11.2 C12.2 R9.1 R10.1 U10.6(VCC) U11.4(Feedback) U12.2 U13.1(ADJ(GND))
+15V: C7.2 C16.2 C19.2 C21.1 D1.1(A) D3.1(K) D4.1(A) D5.1(A) R11.2 U9.1(VCC) U16.1(VCC) U19.1(VCC)
GND: C1.1 C2.1 C3.2 C4.1 C5.2 C7.1 C8.2 C9.2 C10.2 C11.1 C12.1 C13.1 C14.2 C16.1 C17.2 C19.1 C20.2 C21.2 C22.1 C23.1 D2.2(A) R1.1 R13.1 R18.1 R19.2 R20.1 R23.1 R29.1 SW1.1 SW1.2 SW2.1 SW2.2 SW3.1 SW3.2 SW4.1 SW4.2 U1.8(VSSA) U1.23(VSS) U1.47(VSS) U2.2(S) U4.3(S) U9.4(GND) U10.2(SE) U10.4(GND) U11.3(GND) U11.5(ON/OFF) U11.6(GND) U13.3(VIN) U15.3(S) U16.4(GND) U18.3(S) U19.4(GND) U20.4(GND) X1.2 X1.4
GND_DC-: R19.1 R21.1
VCC: C8.1 C14.1 C17.1 C20.1 U3.2(D) U11.1(Vin) U14.2(D) U17.2(D)
PA0_XUAN_BIAN_TIAO0: H3.1
PA1_SPI2_MOSI: H4.1
PA2_SPI2_SCK: H5.1
PA3_SPI2_CS: H6.1
PA8_ATIM_CH1A_U_H: U1.29(PA8) U9.2(HIN)
PA9_ATIM_CH2A_U_H: U16.2(HIN)
PA9_ATIM_CH2A_V_H: U1.30(PA9)
PA10_ATIM_CH3A_U_H: U19.2(HIN)
PA10_ATIM_CH3A_W_H: U1.31(PA10)
PA13_SWDIO: H2.1 U1.34(PA13)
PA14_SWCLK: H1.1 U1.37(PA14)
PA15_SPI1_CS_LCD_A0: U1.38(PA15)
PB3_SPI1_SCK: U1.39(PB3)
PB4_LCD_RST: U1.40(PB4)
PB5_SPI1_MOSI: U1.41(PB5)
PB12_ATIM_BK: R30.2 U1.25(PB12)
PB13_ATIM_CH1B_U_L: U1.26(PB13) U9.3(LIN)
PB14_ATIM_CH2B_U_L: U16.3(LIN)
PB14_ATIM_CH2B_V_L: U1.27(PB14)
PB15_ATIM_CH3B_U_L: U19.3(LIN)
PB15_ATIM_CH3B_W_L: U1.28(PB15)
Net-(C4-2): C4.2 U1.5(PF0-OSC_IN) X1.3
Net-(C5-1): C5.1 U1.6(PF1-OSC_OUT) X1.1
Net-(C6-1): C6.1 TP2.1 U3.3(S) U4.2(D) U9.6(VS)
Net-(C6-2): C6.2 D1.2(K) U9.8(VB)
Net-(C10-1): C10.1 U10.3(CT)
Net-(C15-1): C15.1 TP3.1 U14.3(S) U15.2(D) U16.6(VS)
Net-(C15-2): C15.2 D4.2(K) U16.8(VB)
Net-(C18-1): C18.1 TP1.1 U17.3(S) U18.2(D) U19.6(VS)
Net-(C18-2): C18.2 D5.2(K) U19.8(VB)
Net-(D2-1): D2.1(K) U11.2(Output) U12.1
Net-(D3-2): D3.2(A) L2.2 U10.1(SC)
Net-(H8-1): H8.1 U2.3(D)
Net-(L1-1): L1.1 R8.2 R9.2 R10.2 U10.7(IPK)
Net-(L1-2): L1.2 L2.1
Net-(R1-2): R1.2 U1.44(BOOT0)
Net-(R2-1): R2.1 U1.46(PB9)
Net-(R2-2): R2.2 SW1.3 SW1.4
Net-(R3-1): R3.1 U1.45(PB8)
Net-(R3-2): R3.2 SW2.3 SW2.4
Net-(R4-1): R4.1 U1.43(PB7)
Net-(R4-2): R4.2 SW3.3 SW3.4
Net-(R5-1): R5.1 U1.42(PB6)
Net-(R5-2): R5.2 SW4.3 SW4.4
Net-(R6-1): R6.1 U9.5(LO)
Net-(R6-2): R6.2 U4.1(G)
Net-(R7-1): R7.1 U9.7(HO)
Net-(R7-2): R7.2 U3.1(G)
Net-(R8-1): R8.1 U10.8(DC)
Net-(R11-1): R11.1 R13.2 R18.2 U10.5(FB)
Net-(R14-1): R14.1 U16.5(LO)
Net-(R14-2): R14.2 U15.1(G)
Net-(R15-1): R15.1 U16.7(HO)
Net-(R15-2): R15.2 U14.1(G)
Net-(R16-1): R16.1 U19.5(LO)
Net-(R16-2): R16.2 U18.1(G)
Net-(R17-1): R17.1 U19.7(HO)
Net-(R17-2): R17.2 U17.1(G)
Net-(R20-2): R20.2 R23.2 U20.5(IN2+)
Net-(R21-2): R21.2 R22.1 U20.6(IN2-)
Net-(R22-2): R22.2 U20.3(IN1+) U20.7(OUT2)
Net-(R26-1): R26.1 R27.1 R28.1 R29.2 U20.2(IN1-)
Net-(R30-1): R30.1 U20.1(OUT)

Not connected (* = marked no-connect by the designer): U1 2(PC13) 3(PC14-OSC32_IN) 4(PC15-OSC32_OUT) 7(NRST) 10(PA0) 11(PA1) 12(PA2) 13(PA3) 14(PA4) 15(PA5) 16(PA6) 17(PA7) 18(PB0) 19(PB1) 20(PB2) 21(PB10) 22(PB11) 32(PA11) 33(PA12) 35(PF6) 36(PF7); U2 1(G)

## Notes on the sheets
sheet 1
- SWD口
- 旋转变压器拉低调零
- 旋转变压器解码板
- 旋变电源
sheet 2
- 驱动电路
- 电流限制
- U
- 电
  源
- V
- W
